# Altium schematic sheet Sheet2.SchDoc
size A4; SheetNumber: 2; SheetTotal: 2
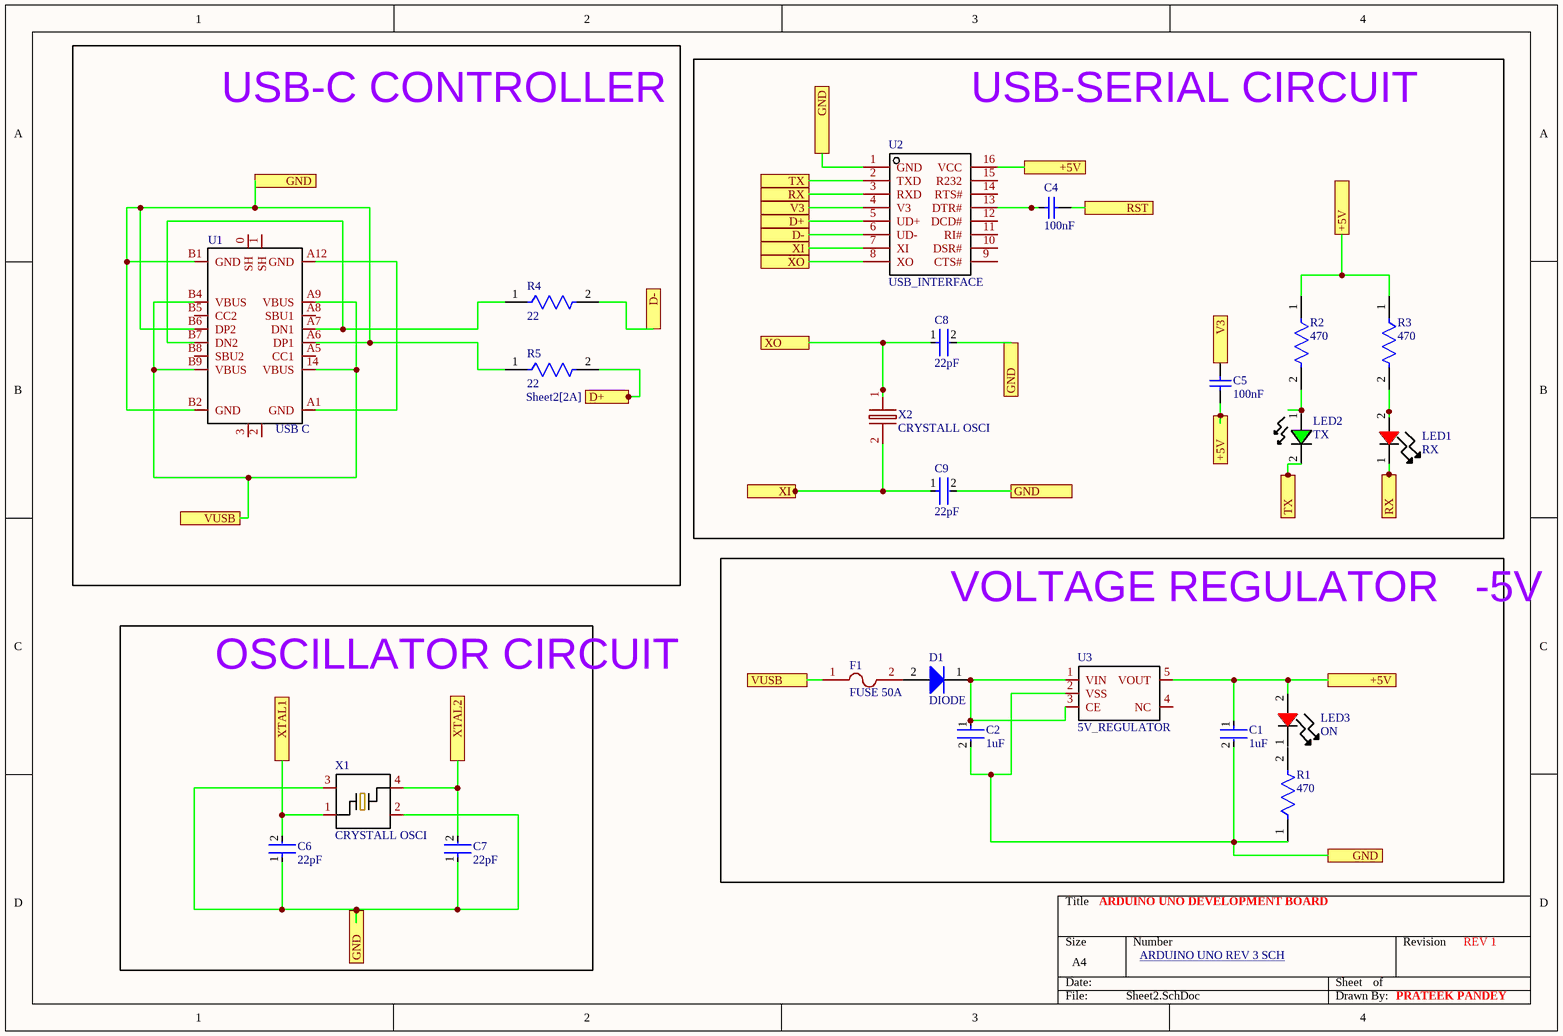
[diagram p0: Sheet2.SchDoc]

## Parts
C1  1uF  [FP-0805-L_2_01_0_2-W_1_25-MFG]
C2  1uF  [FP-0805-L_2_01_0_2-W_1_25-MFG]
C4  100nF  [KEMT-1206-2_M]
C5  100nF  [KEMT-1206-2_M]
C6  22pF  [FP-C0805C-DN-MFG]
C7  22pF  [FP-C0805C-DN-MFG]
C8  22pF  [FP-C0805C-DN-MFG]
C9  22pF  [FP-C0805C-DN-MFG]
D1  DIODE  [ONSC-DSN-2-152AC-01_V]
F1  FUSE 50A  [PCBComponent_1]
LED1  RX  [LED_LSM0805-2P0X1P25X0P8_VCC]
LED2  TX  [LED_05452V_VCC-M]
LED3  ON  [LED_LSM0805-2P0X1P25X0P8_VCC]
R1  470  [FP-CR0805-MFG]
R2  470  [FP-CR0805-MFG]
R3  470  [FP-CR0805-MFG]
R4  22  [FP-CR0603-IPC_A]
R5  22  [FP-CR0603-IPC_A]
U1  USB C  [PCBComponent_1]
U2  USB_INTERFACE  [PCBComponent_1]
U3  5V_REGULATOR  [PCBComponent_1]
X1  CRYSTALL OSCI  [PCBComponent_1]
X2  CRYSTALL OSCI  [PCBComponent_1]

## Blocks framed on the sheet
USB-C CONTROLLER: R4 R5 U1
USB-SERIAL CIRCUIT: C4 C5 C8 C9 LED1 LED2 R2 R3 U2 X2
VOLTAGE REGULATOR   -5V: C1 C2 D1 F1 LED3 R1 U3
OSCILLATOR CIRCUIT: C6 C7 X1

## Ports
+5V (see Sheet1[1B], Sheet1[2D], Sheet1[3C], Sheet2[3A], Sheet2[4A], Sheet2[4B]), +5V (see Sheet1[1B], Sheet1[2D], Sheet1[3C], Sheet2[3A], Sheet2[4A], Sheet2[4C]), +5V (see Sheet1[1B], Sheet1[2D], Sheet1[3C], Sheet2[3A], Sheet2[4B], Sheet2[4C]), +5V (see Sheet1[1B], Sheet1[2D], Sheet1[3C], Sheet2[4A], Sheet2[4B], Sheet2[4C]), D+ (see Sheet2[2A]), D+ (see Sheet2[2B]), D- (see Sheet2[2A]), D- (see Sheet2[2B]), GND (see Sheet1[2A], Sheet1[2D], Sheet1[3B], Sheet1[3D], Sheet1[4D], Sheet2[1A], Sheet2[1D], Sheet2[3A], Sheet2[3B]), GND (see Sheet1[2A], Sheet1[2D], Sheet1[3B], Sheet1[3D], Sheet1[4D], Sheet2[1A], Sheet2[1D], Sheet2[3A], Sheet2[3B], Sheet2[4D]), GND (see Sheet1[2A], Sheet1[2D], Sheet1[3B], Sheet1[3D], Sheet1[4D], Sheet2[1A], Sheet2[1D], Sheet2[3B], Sheet2[4D]), GND (see Sheet1[2A], Sheet1[2D], Sheet1[3B], Sheet1[3D], Sheet1[4D], Sheet2[1A], Sheet2[3A], Sheet2[3B], Sheet2[4D]), GND (see Sheet1[2A], Sheet1[2D], Sheet1[3B], Sheet1[3D], Sheet1[4D], Sheet2[1D], Sheet2[3A], Sheet2[3B], Sheet2[4D]), RST (see Sheet1[1B], Sheet1[2D], Sheet1[4B]), RX (see Sheet1[1B], Sheet1[1D], Sheet2[2A]), RX (see Sheet1[1B], Sheet1[1D], Sheet2[4C]), TX (see Sheet1[1B], Sheet1[1D], Sheet2[2A]), TX (see Sheet1[1B], Sheet1[1D], Sheet2[4C]), V3 (see Sheet2[2A]), V3 (see Sheet2[4B]), VUSB (see Sheet2[1C]), VUSB (see Sheet2[2C]), XI (see Sheet2[2A]), XI (see Sheet2[2B]), XO (see Sheet2[2B]), XTAL1 (see Sheet1[1A]), XTAL2 (see Sheet1[1A])

## Nets
+5V: C1.1 C5.2 LED3.2(+) R2.1 R3.1 U2.16(VCC) U3.5(VOUT) ; port +5V
D+: R5.2 U2.5(UD+) ; port D+
D-: R4.2 U2.6(UD-) ; port D-
GND: C1.2 C2.2 C6.1 C7.1 C8.2 C9.2 R1.1 R5.1 U1.A6(DP1) U1.B1(GND) U1.B2(GND) U1.B6(DP2) U2.1(GND) U3.2(VSS) X1.2 X1.3 ; port GND
RST: C4.1 ; port RST
RX: LED1.1(-) U2.3(RXD) ; port RX
TX: LED2.2 U2.2(TXD) ; port TX
V3: C5.1 U2.4(V3) ; port V3
VUSB: F1.1 U1.14(VBUS) U1.A9(VBUS) U1.B4(VBUS) U1.B9(VBUS) ; port VUSB
XI: C9.1 U2.7(XI) X2.2 ; port XI
XO: C8.1 U2.8(XO) X2.1 ; port XO
XTAL1: C6.2 X1.1 ; port XTAL1
XTAL2: C7.2 X1.4 ; port XTAL2
NetC2_1: C2.1 D1.1(K) U3.1(VIN) U3.3(CE)
NetC4_2: C4.2 U2.13(DTR#)
NetD1_2: D1.2(A) F1.2
NetLED1_2: LED1.2(+) R3.2
NetLED2_1: LED2.1 R2.2
NetR4_1: R4.1 U1.A7(DN1) U1.B7(DN2)
NetU1_A1: U1.A1(GND) U1.A12(GND)

Not connected (* = marked no-connect by the designer): LED3 1(-); R1 2; U1 0(SH) 1(SH) 2 3 A5(CC1) A8(SBU1) B5(CC2) B8(SBU2); U2 9(CTS#) 10(DSR#) 11(RI#) 12(DCD#) 14(RTS#) 15(R232); U3 4(NC)

## Notes on the sheet
- ARDUINO UNO DEVELOPMENT BOARD
- ARDUINO UNO REV 3 SCH <https://docs.arduino.cc/resources/schematics/A000066-schematics.pdf>
- REV 1
- PRATEEK PANDEY

## Library data of the parts
C1 C2 = CMP-2007-04692-2: General Purpose Ceramic Capacitor, 0805, 1uF, 10%, X7R, 15%, 25V; Max Operating Temperature: 125°C; Contact Plating: Tin; Tolerance: 10%; Dielectric: X7R; Case/Package: 0805; Package Quantity: 3000; Width: 0.049inch; Voltage Rating: 25V; Capacitance: 1uF; Lead Free: Lead Free; REACH SVHC: No SVHC; RoHS Compliant: Yes; Case Code (Imperial): 0805; Packaging: Tape and Reel; Dielectric Material: Ceramic; Series: -; Construction: Flat; Termination: SMD/SMT; Radiation Hardening: No; Voltage: 25V; Height: 1.4mm; Number of Pins: 2; Mount: Surface Mount; Length: 2.01mm; Depth: 1.25mm; Voltage Rating (DC): 25V; Min Operating Temperature: -55°C; Thickness: 0.037inch; Case Code (Metric): 2012
C4 C5 = CMP-1037-04202-2: CAP, Ceramic, 0.1 uF, +/- 10%, 50 V, -55 to 125 degC, 1206 (3216 Metric), RoHS, Tape and Reel; Manufacturer: Kemet; Voltage Rating: 50V; Capacitance: 0.1µF; Product Range: KEMET-CSeries; SVHC: ToBeAdvised; Dielectric Characteristic: X7R; Capacitor Case Style: 1206[3216Metric]; Package Reference: 1206-2; Package Description: 2-Leads SMD, Body 3.2 x 1.6 mm; Packaging: Tape&Reel; Operating Temperature Max: 125degC; Capacitance Tolerance: ±10%; Datasheet URL: https://datasheet.ciiva.com/6125/1725438-6125494.pdf; Manufacturer URL: http://www.kemet.com/; Operating Temperature Min: -55degC; Datasheet Version: Jul-13
C6-C9 = CMP-2007-00048-2: Capacitor; Ceramic; Cap; 22.0pF; Tol 5%; SMT; Vol-Rtg 50V; C0G; Tape and Reel; Manufacturer: KEMET; Manufacturer Part Number: C0805C220J5GACTU; Temperature Coefficient: 30ppm/°C; Tolerance: 0.05; Device Class L1: Passive Components; Mouser Description: Multilayer Ceramic Capacitors MLCC - SMD/SMT 50volts 22pF C0G 5%; Temperature Range Low: -55°C; Automotive: No; Voltage Rating: 50 V; Material: Ceramic; Category: Cap; Height: 0.88mm; Temperature Range High: +125°C; Capacitance: 22 pF; Digikey Description: Capacitor; Ceramic; Cap; 22.0pF; Tol 5%; SMT; Vol-Rtg 50V; C0G; Tape and Reel; Octopart: https://octopart.com/c0805c220j5gactu-kemet-145470; ComponentLink2Description: Datasheet; Device Class L2: Capacitors; Ipc Land Pattern Name: CAPC200125X78; Value: 22 pF; RoHS: TRUE; ComponentLink2URL: https://content.kemet.com/datasheets/KEM_C1003_C0G_SMD.pdf; Temperature: -55°C to +125°C; Device Class L3: Ceramic Capacitors; Lead Free: Yes; Temperature Characteristic: C0G; Package: C0805C-DN
D1 = CMP-1055-00232-1: Schottky Barrier Diode, 2-Pin DSN, Pb-Free, Tape and Reel; Manufacturer: On Semiconductor; PartNumber: NSR05F40NXT5G; IFSM Max (A): 10; Configuration: Single; RoHS: TRUE; PackageVersion: Rev. C, 01/2011; ComponentLink3Description: Package Specification; ComponentLink3URL: http://www.onsemi.cn/pub_link/Collateral/152AC.PDF; PackageDescription: 2-Pin Micro Molded Package, Body 1 x 0.6 mm; ComponentLink1URL: http://www.onsemi.com/; ComponentLink1Description: Manufacturer URL; Mounting Technology: Surface Mount; Packing: Tape and Reel; PackageReference: DSN-2-152AC-01; ComponentLink2Description: Datasheet; DatasheetVersion: Rev. 3; ComponentLink2URL: http://www.onsemi.cn/pub_link/Collateral/NSR05F40.PDF
F1 LED1 LED3 U1-U3 X1 X2 = Component_1
LED2 = LSM0805452V: No Description Available; Mfr_Name: VCC
R1-R3 = CMP-07231-001047-1: Thick Film Chip Resistors 0805 470Ω 0.125W 5% 200ppm/°C; Voltage Rating: 150V; Power Rating: 125mW; Resistance: 470R; Max Operating Temperature: 155°C; Depth: 1.25mm; Case Code (Metric): 2012; Mount: Surface Mount; Length: 2mm; REACH SVHC: No SVHC; Case/Package: 0805; Packaging: Tape and Reel; Contact Plating: Tin; Voltage Rating (DC): 150V; Width: 1.25mm; Number of Pins: 2; Termination: SMD/SMT; Height: 0.5mm; Package Quantity: 5000; Min Operating Temperature: -55°C; Lead Free: Contains Lead; Composition: Thick Film; Tolerance: 5%; Temperature Coefficient: 200ppm/°C; Case Code (Imperial): 0805; Radiation Hardening: No; Thickness: 508um; Military Standard: Not
R4 R5 = CMP-07231-005384-1: Thick Film Chip Resistors 0603 22Ω 0.1W 5% 200ppm/°C; Voltage Rating (DC): 50V; Resistance: 22R; Max Power Dissipation: 100mW; Features: Moisture Resistant; REACH SVHC: No SVHC; Height: 0.022inch; Composition: Thick Film; Case/Package: 0603; Packaging: Tape and Reel; Package Quantity: 1; Number of Pins: 2; Min Operating Temperature: -55°C; Depth: 0.8mm; Contact Plating: Tin; Termination: SMD/SMT; Radiation Hardening: No; Max Operating Temperature: 155°C; Case Code (Metric): 1608; Length: 1.6mm; Voltage Rating: 50V; Tolerance: 5%; Mount: Surface Mount; Military Standard: Not; Power Rating: 100mW; Number of Terminations: 2; Case Code (Imperial): 0603; Thickness: 457um; Width: 0.8mm; Temperature Coefficient: 200ppm/°C